# Altium schematic sheet GS_02_Pow.SchDoc: Title
size A3; Date: Date; CompanyName: Integrated Micro-Electronics Bulgaria; Organization: Design & Development Department; Address1: Drawing Type; Address2: Address 1; Address3: Address 2; Address4: Address 3; DocumentNumber: 730xxx; Revision: 01; SheetNumber: 1; SheetTotal: 1; PageSetup: Record=PageOptions|CenterHorizontal=True|CenterVertical=True|PrintScale=0.70|XCorrection=1.00|YCorrection=1.00|PrintKind=2|BorderSize=5000000|LeftOffset=0|BottomOffset=0|Orientation=2|PaperLength=1000|PaperWidth=1000|Scale=100|PaperSource=7|PrintQuality=-4|MediaType=1|DitherType=10|PaperKind=A4|PrintScaleMode=1; SheetSize: A3; Time: Time; ModifiedDate: Mod. Date
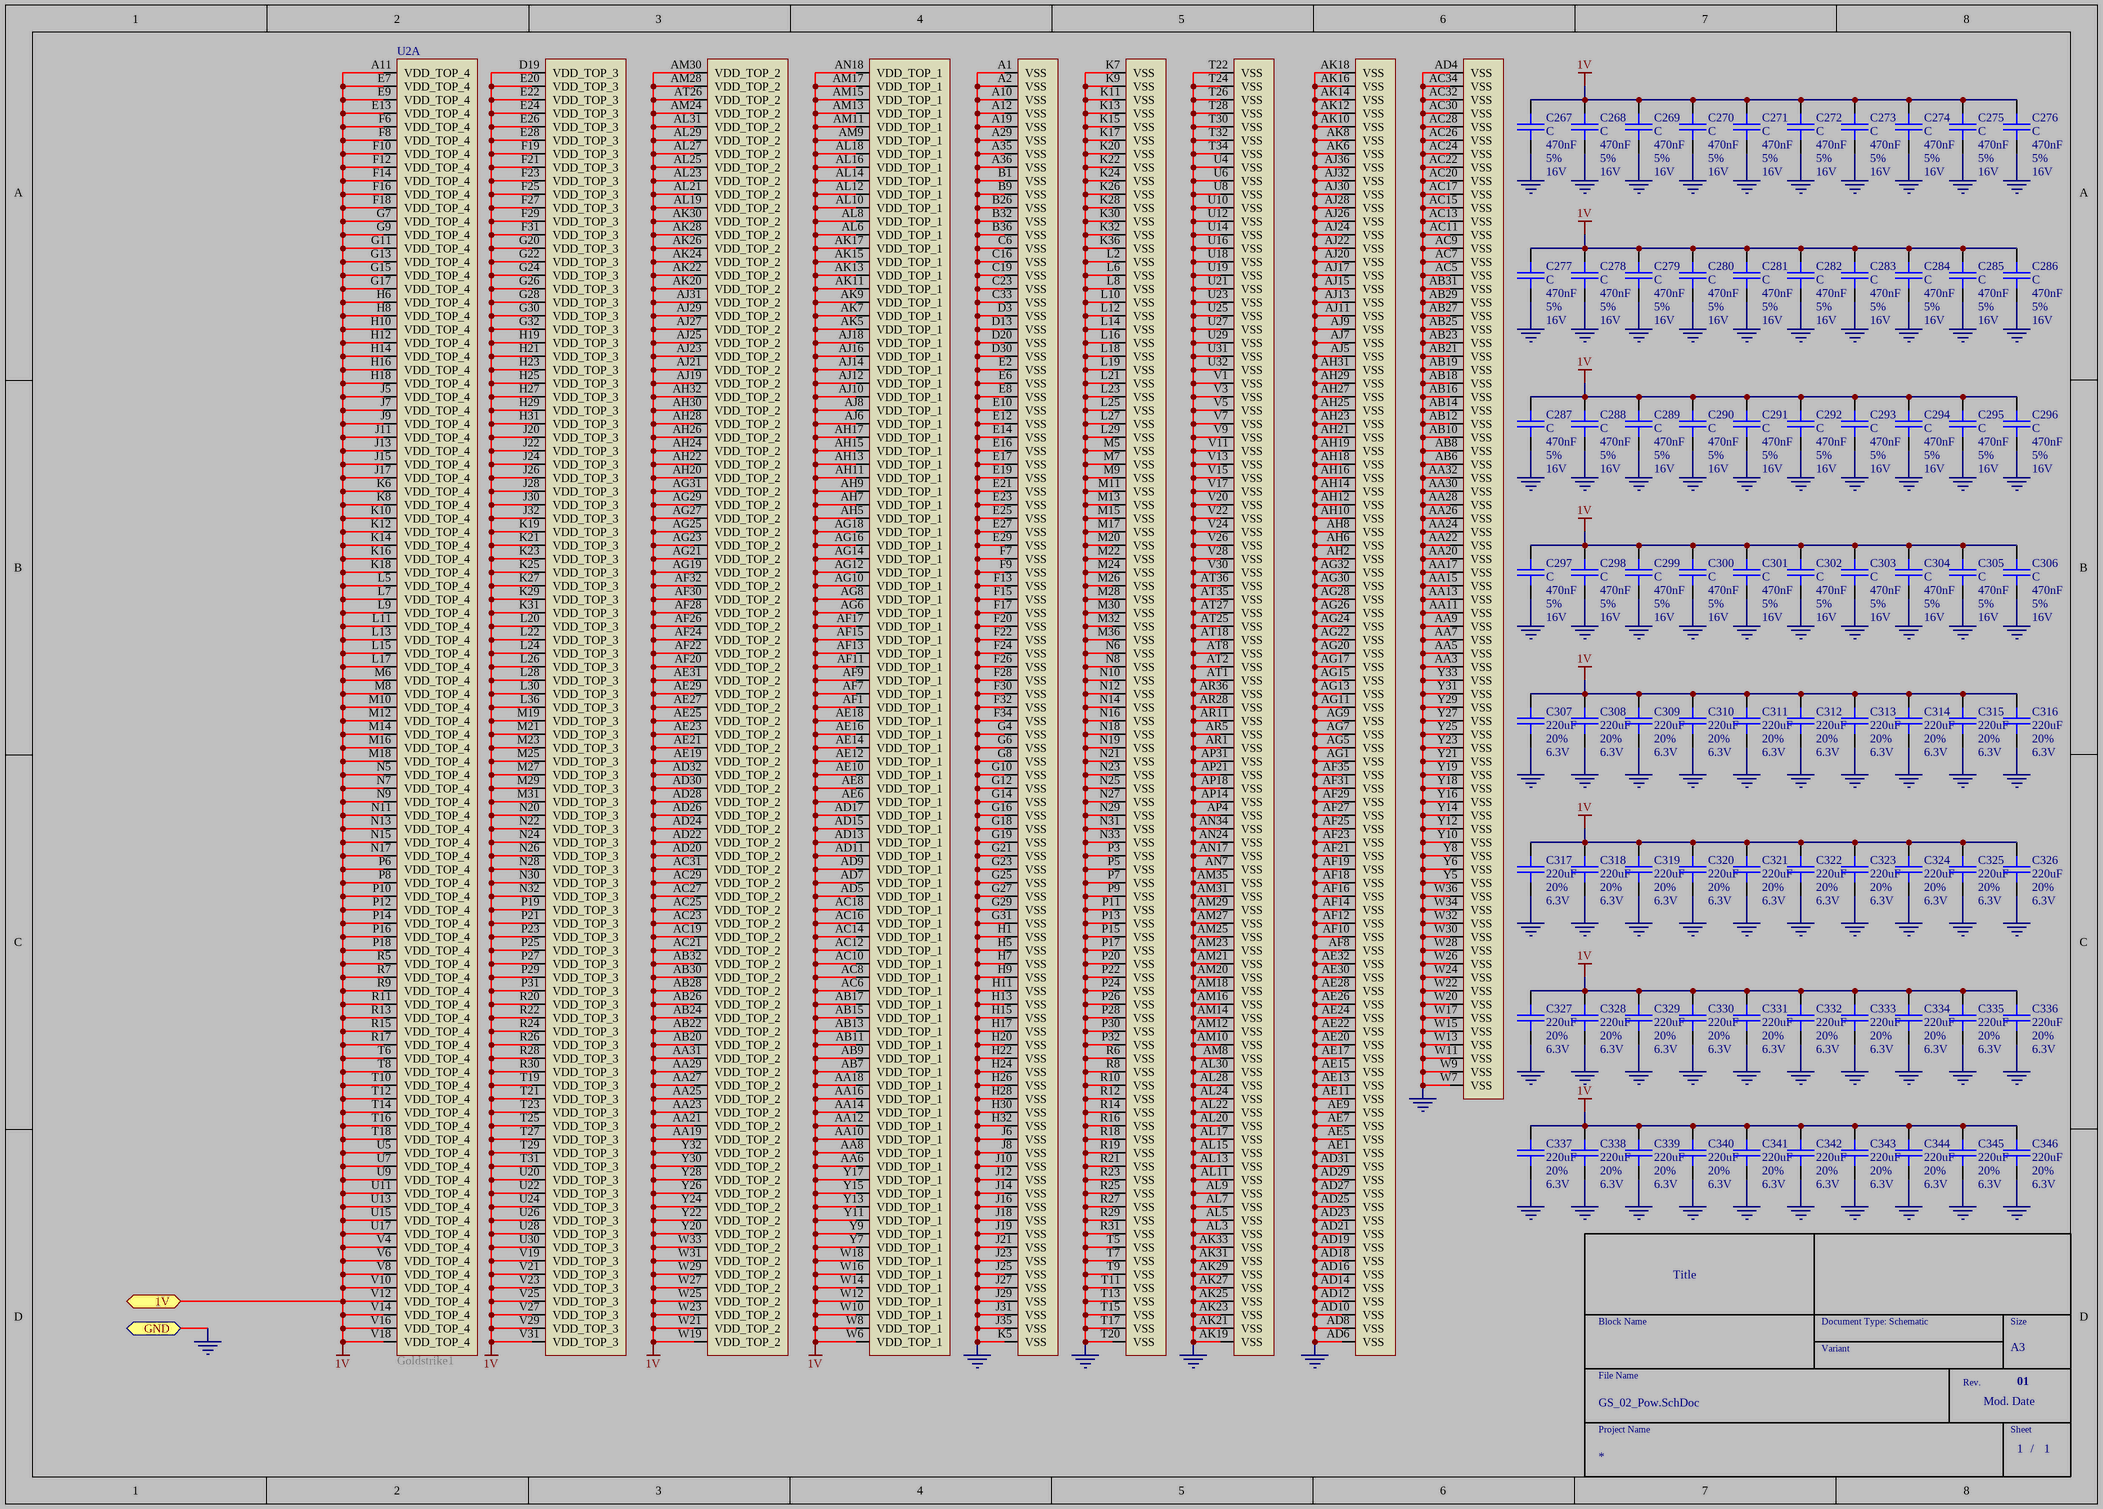
[diagram p0: GS_02_Pow.SchDoc]

## Parts
C267  C  DB_VALUE: 470nF  DB_TOLERANCE: 5%  DB_VOLTAGE: 16V  [SMD_0603_CAPC1608X95N]
C268  C  DB_VALUE: 470nF  DB_TOLERANCE: 5%  DB_VOLTAGE: 16V  [SMD_0603_CAPC1608X95N]
C269  C  DB_VALUE: 470nF  DB_TOLERANCE: 5%  DB_VOLTAGE: 16V  [SMD_0603_CAPC1608X95N]
C270  C  DB_VALUE: 470nF  DB_TOLERANCE: 5%  DB_VOLTAGE: 16V  [SMD_0603_CAPC1608X95N]
C271  C  DB_VALUE: 470nF  DB_TOLERANCE: 5%  DB_VOLTAGE: 16V  [SMD_0603_CAPC1608X95N]
C272  C  DB_VALUE: 470nF  DB_TOLERANCE: 5%  DB_VOLTAGE: 16V  [SMD_0603_CAPC1608X95N]
C273  C  DB_VALUE: 470nF  DB_TOLERANCE: 5%  DB_VOLTAGE: 16V  [SMD_0603_CAPC1608X95N]
C274  C  DB_VALUE: 470nF  DB_TOLERANCE: 5%  DB_VOLTAGE: 16V  [SMD_0603_CAPC1608X95N]
C275  C  DB_VALUE: 470nF  DB_TOLERANCE: 5%  DB_VOLTAGE: 16V  [SMD_0603_CAPC1608X95N]
C276  C  DB_VALUE: 470nF  DB_TOLERANCE: 5%  DB_VOLTAGE: 16V  [SMD_0603_CAPC1608X95N]
C277  C  DB_VALUE: 470nF  DB_TOLERANCE: 5%  DB_VOLTAGE: 16V  [SMD_0603_CAPC1608X95N]
C278  C  DB_VALUE: 470nF  DB_TOLERANCE: 5%  DB_VOLTAGE: 16V  [SMD_0603_CAPC1608X95N]
C279  C  DB_VALUE: 470nF  DB_TOLERANCE: 5%  DB_VOLTAGE: 16V  [SMD_0603_CAPC1608X95N]
C280  C  DB_VALUE: 470nF  DB_TOLERANCE: 5%  DB_VOLTAGE: 16V  [SMD_0603_CAPC1608X95N]
C281  C  DB_VALUE: 470nF  DB_TOLERANCE: 5%  DB_VOLTAGE: 16V  [SMD_0603_CAPC1608X95N]
C282  C  DB_VALUE: 470nF  DB_TOLERANCE: 5%  DB_VOLTAGE: 16V  [SMD_0603_CAPC1608X95N]
C283  C  DB_VALUE: 470nF  DB_TOLERANCE: 5%  DB_VOLTAGE: 16V  [SMD_0603_CAPC1608X95N]
C284  C  DB_VALUE: 470nF  DB_TOLERANCE: 5%  DB_VOLTAGE: 16V  [SMD_0603_CAPC1608X95N]
C285  C  DB_VALUE: 470nF  DB_TOLERANCE: 5%  DB_VOLTAGE: 16V  [SMD_0603_CAPC1608X95N]
C286  C  DB_VALUE: 470nF  DB_TOLERANCE: 5%  DB_VOLTAGE: 16V  [SMD_0603_CAPC1608X95N]
C287  C  DB_VALUE: 470nF  DB_TOLERANCE: 5%  DB_VOLTAGE: 16V  [SMD_0603_CAPC1608X95N]
C288  C  DB_VALUE: 470nF  DB_TOLERANCE: 5%  DB_VOLTAGE: 16V  [SMD_0603_CAPC1608X95N]
C289  C  DB_VALUE: 470nF  DB_TOLERANCE: 5%  DB_VOLTAGE: 16V  [SMD_0603_CAPC1608X95N]
C290  C  DB_VALUE: 470nF  DB_TOLERANCE: 5%  DB_VOLTAGE: 16V  [SMD_0603_CAPC1608X95N]
C291  C  DB_VALUE: 470nF  DB_TOLERANCE: 5%  DB_VOLTAGE: 16V  [SMD_0603_CAPC1608X95N]
C292  C  DB_VALUE: 470nF  DB_TOLERANCE: 5%  DB_VOLTAGE: 16V  [SMD_0603_CAPC1608X95N]
C293  C  DB_VALUE: 470nF  DB_TOLERANCE: 5%  DB_VOLTAGE: 16V  [SMD_0603_CAPC1608X95N]
C294  C  DB_VALUE: 470nF  DB_TOLERANCE: 5%  DB_VOLTAGE: 16V  [SMD_0603_CAPC1608X95N]
C295  C  DB_VALUE: 470nF  DB_TOLERANCE: 5%  DB_VOLTAGE: 16V  [SMD_0603_CAPC1608X95N]
C296  C  DB_VALUE: 470nF  DB_TOLERANCE: 5%  DB_VOLTAGE: 16V  [SMD_0603_CAPC1608X95N]
C297  C  DB_VALUE: 470nF  DB_TOLERANCE: 5%  DB_VOLTAGE: 16V  [SMD_0603_CAPC1608X95N]
C298  C  DB_VALUE: 470nF  DB_TOLERANCE: 5%  DB_VOLTAGE: 16V  [SMD_0603_CAPC1608X95N]
C299  C  DB_VALUE: 470nF  DB_TOLERANCE: 5%  DB_VOLTAGE: 16V  [SMD_0603_CAPC1608X95N]
C300  C  DB_VALUE: 470nF  DB_TOLERANCE: 5%  DB_VOLTAGE: 16V  [SMD_0603_CAPC1608X95N]
C301  C  DB_VALUE: 470nF  DB_TOLERANCE: 5%  DB_VOLTAGE: 16V  [SMD_0603_CAPC1608X95N]
C302  C  DB_VALUE: 470nF  DB_TOLERANCE: 5%  DB_VOLTAGE: 16V  [SMD_0603_CAPC1608X95N]
C303  C  DB_VALUE: 470nF  DB_TOLERANCE: 5%  DB_VOLTAGE: 16V  [SMD_0603_CAPC1608X95N]
C304  C  DB_VALUE: 470nF  DB_TOLERANCE: 5%  DB_VOLTAGE: 16V  [SMD_0603_CAPC1608X95N]
C305  C  DB_VALUE: 470nF  DB_TOLERANCE: 5%  DB_VOLTAGE: 16V  [SMD_0603_CAPC1608X95N]
C306  C  DB_VALUE: 470nF  DB_TOLERANCE: 5%  DB_VOLTAGE: 16V  [SMD_0603_CAPC1608X95N]
C307  DB_VALUE: 220uF  DB_TOLERANCE: 20%  DB_VOLTAGE: 6.3V  [SMD_1210_CAPC3225X279N]  (hidden comment: C)
C308  DB_VALUE: 220uF  DB_TOLERANCE: 20%  DB_VOLTAGE: 6.3V  [SMD_1210_CAPC3225X279N]  (hidden comment: C)
C309  DB_VALUE: 220uF  DB_TOLERANCE: 20%  DB_VOLTAGE: 6.3V  [SMD_1210_CAPC3225X279N]  (hidden comment: C)
C310  DB_VALUE: 220uF  DB_TOLERANCE: 20%  DB_VOLTAGE: 6.3V  [SMD_1210_CAPC3225X279N]  (hidden comment: C)
C311  DB_VALUE: 220uF  DB_TOLERANCE: 20%  DB_VOLTAGE: 6.3V  [SMD_1210_CAPC3225X279N]  (hidden comment: C)
C312  DB_VALUE: 220uF  DB_TOLERANCE: 20%  DB_VOLTAGE: 6.3V  [SMD_1210_CAPC3225X279N]  (hidden comment: C)
C313  DB_VALUE: 220uF  DB_TOLERANCE: 20%  DB_VOLTAGE: 6.3V  [SMD_1210_CAPC3225X279N]  (hidden comment: C)
C314  DB_VALUE: 220uF  DB_TOLERANCE: 20%  DB_VOLTAGE: 6.3V  [SMD_1210_CAPC3225X279N]  (hidden comment: C)
C315  DB_VALUE: 220uF  DB_TOLERANCE: 20%  DB_VOLTAGE: 6.3V  [SMD_1210_CAPC3225X279N]  (hidden comment: C)
C316  DB_VALUE: 220uF  DB_TOLERANCE: 20%  DB_VOLTAGE: 6.3V  [SMD_1210_CAPC3225X279N]  (hidden comment: C)
C317  DB_VALUE: 220uF  DB_TOLERANCE: 20%  DB_VOLTAGE: 6.3V  [SMD_1210_CAPC3225X279N]  (hidden comment: C)
C318  DB_VALUE: 220uF  DB_TOLERANCE: 20%  DB_VOLTAGE: 6.3V  [SMD_1210_CAPC3225X279N]  (hidden comment: C)
C319  DB_VALUE: 220uF  DB_TOLERANCE: 20%  DB_VOLTAGE: 6.3V  [SMD_1210_CAPC3225X279N]  (hidden comment: C)
C320  DB_VALUE: 220uF  DB_TOLERANCE: 20%  DB_VOLTAGE: 6.3V  [SMD_1210_CAPC3225X279N]  (hidden comment: C)
C321  DB_VALUE: 220uF  DB_TOLERANCE: 20%  DB_VOLTAGE: 6.3V  [SMD_1210_CAPC3225X279N]  (hidden comment: C)
C322  DB_VALUE: 220uF  DB_TOLERANCE: 20%  DB_VOLTAGE: 6.3V  [SMD_1210_CAPC3225X279N]  (hidden comment: C)
C323  DB_VALUE: 220uF  DB_TOLERANCE: 20%  DB_VOLTAGE: 6.3V  [SMD_1210_CAPC3225X279N]  (hidden comment: C)
C324  DB_VALUE: 220uF  DB_TOLERANCE: 20%  DB_VOLTAGE: 6.3V  [SMD_1210_CAPC3225X279N]  (hidden comment: C)
C325  DB_VALUE: 220uF  DB_TOLERANCE: 20%  DB_VOLTAGE: 6.3V  [SMD_1210_CAPC3225X279N]  (hidden comment: C)
C326  DB_VALUE: 220uF  DB_TOLERANCE: 20%  DB_VOLTAGE: 6.3V  [SMD_1210_CAPC3225X279N]  (hidden comment: C)
C327  DB_VALUE: 220uF  DB_TOLERANCE: 20%  DB_VOLTAGE: 6.3V  [SMD_1210_CAPC3225X279N]  (hidden comment: C)
C328  DB_VALUE: 220uF  DB_TOLERANCE: 20%  DB_VOLTAGE: 6.3V  [SMD_1210_CAPC3225X279N]  (hidden comment: C)
C329  DB_VALUE: 220uF  DB_TOLERANCE: 20%  DB_VOLTAGE: 6.3V  [SMD_1210_CAPC3225X279N]  (hidden comment: C)
C330  DB_VALUE: 220uF  DB_TOLERANCE: 20%  DB_VOLTAGE: 6.3V  [SMD_1210_CAPC3225X279N]  (hidden comment: C)
C331  DB_VALUE: 220uF  DB_TOLERANCE: 20%  DB_VOLTAGE: 6.3V  [SMD_1210_CAPC3225X279N]  (hidden comment: C)
C332  DB_VALUE: 220uF  DB_TOLERANCE: 20%  DB_VOLTAGE: 6.3V  [SMD_1210_CAPC3225X279N]  (hidden comment: C)
C333  DB_VALUE: 220uF  DB_TOLERANCE: 20%  DB_VOLTAGE: 6.3V  [SMD_1210_CAPC3225X279N]  (hidden comment: C)
C334  DB_VALUE: 220uF  DB_TOLERANCE: 20%  DB_VOLTAGE: 6.3V  [SMD_1210_CAPC3225X279N]  (hidden comment: C)
C335  DB_VALUE: 220uF  DB_TOLERANCE: 20%  DB_VOLTAGE: 6.3V  [SMD_1210_CAPC3225X279N]  (hidden comment: C)
C336  DB_VALUE: 220uF  DB_TOLERANCE: 20%  DB_VOLTAGE: 6.3V  [SMD_1210_CAPC3225X279N]  (hidden comment: C)
C337  DB_VALUE: 220uF  DB_TOLERANCE: 20%  DB_VOLTAGE: 6.3V  [SMD_1210_CAPC3225X279N]  (hidden comment: C)
C338  DB_VALUE: 220uF  DB_TOLERANCE: 20%  DB_VOLTAGE: 6.3V  [SMD_1210_CAPC3225X279N]  (hidden comment: C)
C339  DB_VALUE: 220uF  DB_TOLERANCE: 20%  DB_VOLTAGE: 6.3V  [SMD_1210_CAPC3225X279N]  (hidden comment: C)
C340  DB_VALUE: 220uF  DB_TOLERANCE: 20%  DB_VOLTAGE: 6.3V  [SMD_1210_CAPC3225X279N]  (hidden comment: C)
C341  DB_VALUE: 220uF  DB_TOLERANCE: 20%  DB_VOLTAGE: 6.3V  [SMD_1210_CAPC3225X279N]  (hidden comment: C)
C342  DB_VALUE: 220uF  DB_TOLERANCE: 20%  DB_VOLTAGE: 6.3V  [SMD_1210_CAPC3225X279N]  (hidden comment: C)
C343  DB_VALUE: 220uF  DB_TOLERANCE: 20%  DB_VOLTAGE: 6.3V  [SMD_1210_CAPC3225X279N]  (hidden comment: C)
C344  DB_VALUE: 220uF  DB_TOLERANCE: 20%  DB_VOLTAGE: 6.3V  [SMD_1210_CAPC3225X279N]  (hidden comment: C)
C345  DB_VALUE: 220uF  DB_TOLERANCE: 20%  DB_VOLTAGE: 6.3V  [SMD_1210_CAPC3225X279N]  (hidden comment: C)
C346  DB_VALUE: 220uF  DB_TOLERANCE: 20%  DB_VOLTAGE: 6.3V  [SMD_1210_CAPC3225X279N]  (hidden comment: C)
U2  Goldstrike1  [SMD_BGA1296C100P36X36]  (part A of 5)

## Ports
1V, GND

## Nets
1V: C267.2 C268.2 C269.2 C270.2 C271.2 C272.2 C273.2 C274.2 C275.2 C276.2 C277.2 C278.2 C279.2 C280.2 C281.2 C282.2 C283.2 C284.2 C285.2 C286.2 C287.2 C288.2 C289.2 C290.2 C291.2 C292.2 C293.2 C294.2 C295.2 C296.2 C297.2 C298.2 C299.2 C300.2 C301.2 C302.2 C303.2 C304.2 C305.2 C306.2 C307.2 C308.2 C309.2 C310.2 C311.2 C312.2 C313.2 C314.2 C315.2 C316.2 C317.2 C318.2 C319.2 C320.2 C321.2 C322.2 C323.2 C324.2 C325.2 C326.2 C327.2 C328.2 C329.2 C330.2 C331.2 C332.2 C333.2 C334.2 C335.2 C336.2 C337.2 C338.2 C339.2 C340.2 C341.2 C342.2 C343.2 C344.2 C345.2 C346.2 U2.A11(VDD_TOP_4) U2.AA6(VDD_TOP_1) U2.AA8(VDD_TOP_1) U2.AA10(VDD_TOP_1) U2.AA12(VDD_TOP_1) U2.AA14(VDD_TOP_1) U2.AA16(VDD_TOP_1) U2.AA18(VDD_TOP_1) U2.AA19(VDD_TOP_2) U2.AA21(VDD_TOP_2) U2.AA23(VDD_TOP_2) U2.AA25(VDD_TOP_2) U2.AA27(VDD_TOP_2) U2.AA29(VDD_TOP_2) U2.AA31(VDD_TOP_2) U2.AB7(VDD_TOP_1) U2.AB9(VDD_TOP_1) U2.AB11(VDD_TOP_1) U2.AB13(VDD_TOP_1) U2.AB15(VDD_TOP_1) U2.AB17(VDD_TOP_1) U2.AB20(VDD_TOP_2) U2.AB22(VDD_TOP_2) U2.AB24(VDD_TOP_2) U2.AB26(VDD_TOP_2) U2.AB28(VDD_TOP_2) U2.AB30(VDD_TOP_2) U2.AB32(VDD_TOP_2) U2.AC6(VDD_TOP_1) U2.AC8(VDD_TOP_1) U2.AC10(VDD_TOP_1) U2.AC12(VDD_TOP_1) U2.AC14(VDD_TOP_1) U2.AC16(VDD_TOP_1) U2.AC18(VDD_TOP_1) U2.AC19(VDD_TOP_2) U2.AC21(VDD_TOP_2) U2.AC23(VDD_TOP_2) U2.AC25(VDD_TOP_2) U2.AC27(VDD_TOP_2) U2.AC29(VDD_TOP_2) U2.AC31(VDD_TOP_2) U2.AD5(VDD_TOP_1) U2.AD7(VDD_TOP_1) U2.AD9(VDD_TOP_1) U2.AD11(VDD_TOP_1) U2.AD13(VDD_TOP_1) U2.AD15(VDD_TOP_1) U2.AD17(VDD_TOP_1) U2.AD20(VDD_TOP_2) U2.AD22(VDD_TOP_2) U2.AD24(VDD_TOP_2) U2.AD26(VDD_TOP_2) U2.AD28(VDD_TOP_2) U2.AD30(VDD_TOP_2) U2.AD32(VDD_TOP_2) U2.AE6(VDD_TOP_1) U2.AE8(VDD_TOP_1) U2.AE10(VDD_TOP_1) U2.AE12(VDD_TOP_1) U2.AE14(VDD_TOP_1) U2.AE16(VDD_TOP_1) U2.AE18(VDD_TOP_1) U2.AE19(VDD_TOP_2) U2.AE21(VDD_TOP_2) U2.AE23(VDD_TOP_2) U2.AE25(VDD_TOP_2) U2.AE27(VDD_TOP_2) U2.AE29(VDD_TOP_2) U2.AE31(VDD_TOP_2) U2.AF1(VDD_TOP_1) U2.AF7(VDD_TOP_1) U2.AF9(VDD_TOP_1) U2.AF11(VDD_TOP_1) U2.AF13(VDD_TOP_1) U2.AF15(VDD_TOP_1) U2.AF17(VDD_TOP_1) U2.AF20(VDD_TOP_2) U2.AF22(VDD_TOP_2) U2.AF24(VDD_TOP_2) U2.AF26(VDD_TOP_2) U2.AF28(VDD_TOP_2) U2.AF30(VDD_TOP_2) U2.AF32(VDD_TOP_2) U2.AG6(VDD_TOP_1) U2.AG8(VDD_TOP_1) U2.AG10(VDD_TOP_1) U2.AG12(VDD_TOP_1) U2.AG14(VDD_TOP_1) U2.AG16(VDD_TOP_1) U2.AG18(VDD_TOP_1) U2.AG19(VDD_TOP_2) U2.AG21(VDD_TOP_2) U2.AG23(VDD_TOP_2) U2.AG25(VDD_TOP_2) U2.AG27(VDD_TOP_2) U2.AG29(VDD_TOP_2) U2.AG31(VDD_TOP_2) U2.AH5(VDD_TOP_1) U2.AH7(VDD_TOP_1) U2.AH9(VDD_TOP_1) U2.AH11(VDD_TOP_1) U2.AH13(VDD_TOP_1) U2.AH15(VDD_TOP_1) U2.AH17(VDD_TOP_1) U2.AH20(VDD_TOP_2) U2.AH22(VDD_TOP_2) U2.AH24(VDD_TOP_2) U2.AH26(VDD_TOP_2) U2.AH28(VDD_TOP_2) U2.AH30(VDD_TOP_2) U2.AH32(VDD_TOP_2) U2.AJ6(VDD_TOP_1) U2.AJ8(VDD_TOP_1) U2.AJ10(VDD_TOP_1) U2.AJ12(VDD_TOP_1) U2.AJ14(VDD_TOP_1) U2.AJ16(VDD_TOP_1) U2.AJ18(VDD_TOP_1) U2.AJ19(VDD_TOP_2) U2.AJ21(VDD_TOP_2) U2.AJ23(VDD_TOP_2) U2.AJ25(VDD_TOP_2) U2.AJ27(VDD_TOP_2) U2.AJ29(VDD_TOP_2) U2.AJ31(VDD_TOP_2) U2.AK5(VDD_TOP_1) U2.AK7(VDD_TOP_1) U2.AK9(VDD_TOP_1) U2.AK11(VDD_TOP_1) U2.AK13(VDD_TOP_1) U2.AK15(VDD_TOP_1) U2.AK17(VDD_TOP_1) U2.AK20(VDD_TOP_2) U2.AK22(VDD_TOP_2) U2.AK24(VDD_TOP_2) U2.AK26(VDD_TOP_2) U2.AK28(VDD_TOP_2) U2.AK30(VDD_TOP_2) U2.AL6(VDD_TOP_1) U2.AL8(VDD_TOP_1) U2.AL10(VDD_TOP_1) U2.AL12(VDD_TOP_1) U2.AL14(VDD_TOP_1) U2.AL16(VDD_TOP_1) U2.AL18(VDD_TOP_1) U2.AL19(VDD_TOP_2) U2.AL21(VDD_TOP_2) U2.AL23(VDD_TOP_2) U2.AL25(VDD_TOP_2) U2.AL27(VDD_TOP_2) U2.AL29(VDD_TOP_2) U2.AL31(VDD_TOP_2) U2.AM9(VDD_TOP_1) U2.AM11(VDD_TOP_1) U2.AM13(VDD_TOP_1) U2.AM15(VDD_TOP_1) U2.AM17(VDD_TOP_1) U2.AM24(VDD_TOP_2) U2.AM28(VDD_TOP_2) U2.AM30(VDD_TOP_2) U2.AN18(VDD_TOP_1) U2.AT26(VDD_TOP_2) U2.D19(VDD_TOP_3) U2.E7(VDD_TOP_4) U2.E9(VDD_TOP_4) U2.E13(VDD_TOP_4) U2.E20(VDD_TOP_3) U2.E22(VDD_TOP_3) U2.E24(VDD_TOP_3) U2.E26(VDD_TOP_3) U2.E28(VDD_TOP_3) U2.F6(VDD_TOP_4) U2.F8(VDD_TOP_4) U2.F10(VDD_TOP_4) U2.F12(VDD_TOP_4) U2.F14(VDD_TOP_4) U2.F16(VDD_TOP_4) U2.F18(VDD_TOP_4) U2.F19(VDD_TOP_3) U2.F21(VDD_TOP_3) U2.F23(VDD_TOP_3) U2.F25(VDD_TOP_3) U2.F27(VDD_TOP_3) U2.F29(VDD_TOP_3) U2.F31(VDD_TOP_3) U2.G7(VDD_TOP_4) U2.G9(VDD_TOP_4) U2.G11(VDD_TOP_4) U2.G13(VDD_TOP_4) U2.G15(VDD_TOP_4) U2.G17(VDD_TOP_4) U2.G20(VDD_TOP_3) U2.G22(VDD_TOP_3) U2.G24(VDD_TOP_3) U2.G26(VDD_TOP_3) U2.G28(VDD_TOP_3) U2.G30(VDD_TOP_3) U2.G32(VDD_TOP_3) U2.H6(VDD_TOP_4) U2.H8(VDD_TOP_4) U2.H10(VDD_TOP_4) U2.H12(VDD_TOP_4) U2.H14(VDD_TOP_4) U2.H16(VDD_TOP_4) U2.H18(VDD_TOP_4) U2.H19(VDD_TOP_3) U2.H21(VDD_TOP_3) U2.H23(VDD_TOP_3) U2.H25(VDD_TOP_3) U2.H27(VDD_TOP_3) U2.H29(VDD_TOP_3) U2.H31(VDD_TOP_3) U2.J5(VDD_TOP_4) U2.J7(VDD_TOP_4) U2.J9(VDD_TOP_4) U2.J11(VDD_TOP_4) U2.J13(VDD_TOP_4) U2.J15(VDD_TOP_4) U2.J17(VDD_TOP_4) U2.J20(VDD_TOP_3) U2.J22(VDD_TOP_3) U2.J24(VDD_TOP_3) U2.J26(VDD_TOP_3) U2.J28(VDD_TOP_3) U2.J30(VDD_TOP_3) U2.J32(VDD_TOP_3) U2.K6(VDD_TOP_4) U2.K8(VDD_TOP_4) U2.K10(VDD_TOP_4) U2.K12(VDD_TOP_4) U2.K14(VDD_TOP_4) U2.K16(VDD_TOP_4) U2.K18(VDD_TOP_4) U2.K19(VDD_TOP_3) U2.K21(VDD_TOP_3) U2.K23(VDD_TOP_3) U2.K25(VDD_TOP_3) U2.K27(VDD_TOP_3) U2.K29(VDD_TOP_3) U2.K31(VDD_TOP_3) U2.L5(VDD_TOP_4) U2.L7(VDD_TOP_4) U2.L9(VDD_TOP_4) U2.L11(VDD_TOP_4) U2.L13(VDD_TOP_4) U2.L15(VDD_TOP_4) U2.L17(VDD_TOP_4) U2.L20(VDD_TOP_3) U2.L22(VDD_TOP_3) U2.L24(VDD_TOP_3) U2.L26(VDD_TOP_3) U2.L28(VDD_TOP_3) U2.L30(VDD_TOP_3) U2.L36(VDD_TOP_3) U2.M6(VDD_TOP_4) U2.M8(VDD_TOP_4) U2.M10(VDD_TOP_4) U2.M12(VDD_TOP_4) U2.M14(VDD_TOP_4) U2.M16(VDD_TOP_4) U2.M18(VDD_TOP_4) U2.M19(VDD_TOP_3) U2.M21(VDD_TOP_3) U2.M23(VDD_TOP_3) U2.M25(VDD_TOP_3) U2.M27(VDD_TOP_3) U2.M29(VDD_TOP_3) U2.M31(VDD_TOP_3) U2.N5(VDD_TOP_4) U2.N7(VDD_TOP_4) U2.N9(VDD_TOP_4) U2.N11(VDD_TOP_4) U2.N13(VDD_TOP_4) U2.N15(VDD_TOP_4) U2.N17(VDD_TOP_4) U2.N20(VDD_TOP_3) U2.N22(VDD_TOP_3) U2.N24(VDD_TOP_3) U2.N26(VDD_TOP_3) U2.N28(VDD_TOP_3) U2.N30(VDD_TOP_3) U2.N32(VDD_TOP_3) U2.P6(VDD_TOP_4) U2.P8(VDD_TOP_4) U2.P10(VDD_TOP_4) U2.P12(VDD_TOP_4) U2.P14(VDD_TOP_4) U2.P16(VDD_TOP_4) U2.P18(VDD_TOP_4) U2.P19(VDD_TOP_3) U2.P21(VDD_TOP_3) U2.P23(VDD_TOP_3) U2.P25(VDD_TOP_3) U2.P27(VDD_TOP_3) U2.P29(VDD_TOP_3) U2.P31(VDD_TOP_3) U2.R5(VDD_TOP_4) U2.R7(VDD_TOP_4) U2.R9(VDD_TOP_4) U2.R11(VDD_TOP_4) U2.R13(VDD_TOP_4) U2.R15(VDD_TOP_4) U2.R17(VDD_TOP_4) U2.R20(VDD_TOP_3) U2.R22(VDD_TOP_3) U2.R24(VDD_TOP_3) U2.R26(VDD_TOP_3) U2.R28(VDD_TOP_3) U2.R30(VDD_TOP_3) U2.T6(VDD_TOP_4) U2.T8(VDD_TOP_4) U2.T10(VDD_TOP_4) U2.T12(VDD_TOP_4) U2.T14(VDD_TOP_4) U2.T16(VDD_TOP_4) U2.T18(VDD_TOP_4) U2.T19(VDD_TOP_3) U2.T21(VDD_TOP_3) U2.T23(VDD_TOP_3) U2.T25(VDD_TOP_3) U2.T27(VDD_TOP_3) U2.T29(VDD_TOP_3) U2.T31(VDD_TOP_3) U2.U5(VDD_TOP_4) U2.U7(VDD_TOP_4) U2.U9(VDD_TOP_4) U2.U11(VDD_TOP_4) U2.U13(VDD_TOP_4) U2.U15(VDD_TOP_4) U2.U17(VDD_TOP_4) U2.U20(VDD_TOP_3) U2.U22(VDD_TOP_3) U2.U24(VDD_TOP_3) U2.U26(VDD_TOP_3) U2.U28(VDD_TOP_3) U2.U30(VDD_TOP_3) U2.V4(VDD_TOP_4) U2.V6(VDD_TOP_4) U2.V8(VDD_TOP_4) U2.V10(VDD_TOP_4) U2.V12(VDD_TOP_4) U2.V14(VDD_TOP_4) U2.V16(VDD_TOP_4) U2.V18(VDD_TOP_4) U2.V19(VDD_TOP_3) U2.V21(VDD_TOP_3) U2.V23(VDD_TOP_3) U2.V25(VDD_TOP_3) U2.V27(VDD_TOP_3) U2.V29(VDD_TOP_3) U2.V31(VDD_TOP_3) U2.W6(VDD_TOP_1) U2.W8(VDD_TOP_1) U2.W10(VDD_TOP_1) U2.W12(VDD_TOP_1) U2.W14(VDD_TOP_1) U2.W16(VDD_TOP_1) U2.W18(VDD_TOP_1) U2.W19(VDD_TOP_2) U2.W21(VDD_TOP_2) U2.W23(VDD_TOP_2) U2.W25(VDD_TOP_2) U2.W27(VDD_TOP_2) U2.W29(VDD_TOP_2) U2.W31(VDD_TOP_2) U2.W33(VDD_TOP_2) U2.Y7(VDD_TOP_1) U2.Y9(VDD_TOP_1) U2.Y11(VDD_TOP_1) U2.Y13(VDD_TOP_1) U2.Y15(VDD_TOP_1) U2.Y17(VDD_TOP_1) U2.Y20(VDD_TOP_2) U2.Y22(VDD_TOP_2) U2.Y24(VDD_TOP_2) U2.Y26(VDD_TOP_2) U2.Y28(VDD_TOP_2) U2.Y30(VDD_TOP_2) U2.Y32(VDD_TOP_2) ; port 1V
GND: C267.1 C268.1 C269.1 C270.1 C271.1 C272.1 C273.1 C274.1 C275.1 C276.1 C277.1 C278.1 C279.1 C280.1 C281.1 C282.1 C283.1 C284.1 C285.1 C286.1 C287.1 C288.1 C289.1 C290.1 C291.1 C292.1 C293.1 C294.1 C295.1 C296.1 C297.1 C298.1 C299.1 C300.1 C301.1 C302.1 C303.1 C304.1 C305.1 C306.1 C307.1 C308.1 C309.1 C310.1 C311.1 C312.1 C313.1 C314.1 C315.1 C316.1 C317.1 C318.1 C319.1 C320.1 C321.1 C322.1 C323.1 C324.1 C325.1 C326.1 C327.1 C328.1 C329.1 C330.1 C331.1 C332.1 C333.1 C334.1 C335.1 C336.1 C337.1 C338.1 C339.1 C340.1 C341.1 C342.1 C343.1 C344.1 C345.1 C346.1 U2.A1(VSS) U2.A2(VSS) U2.A10(VSS) U2.A12(VSS) U2.A19(VSS) U2.A29(VSS) U2.A35(VSS) U2.A36(VSS) U2.AA3(VSS) U2.AA5(VSS) U2.AA7(VSS) U2.AA9(VSS) U2.AA11(VSS) U2.AA13(VSS) U2.AA15(VSS) U2.AA17(VSS) U2.AA20(VSS) U2.AA22(VSS) U2.AA24(VSS) U2.AA26(VSS) U2.AA28(VSS) U2.AA30(VSS) U2.AA32(VSS) U2.AB6(VSS) U2.AB8(VSS) U2.AB10(VSS) U2.AB12(VSS) U2.AB14(VSS) U2.AB16(VSS) U2.AB18(VSS) U2.AB19(VSS) U2.AB21(VSS) U2.AB23(VSS) U2.AB25(VSS) U2.AB27(VSS) U2.AB29(VSS) U2.AB31(VSS) U2.AC5(VSS) U2.AC7(VSS) U2.AC9(VSS) U2.AC11(VSS) U2.AC13(VSS) U2.AC15(VSS) U2.AC17(VSS) U2.AC20(VSS) U2.AC22(VSS) U2.AC24(VSS) U2.AC26(VSS) U2.AC28(VSS) U2.AC30(VSS) U2.AC32(VSS) U2.AC34(VSS) U2.AD4(VSS) U2.AD6(VSS) U2.AD8(VSS) U2.AD10(VSS) U2.AD12(VSS) U2.AD14(VSS) U2.AD16(VSS) U2.AD18(VSS) U2.AD19(VSS) U2.AD21(VSS) U2.AD23(VSS) U2.AD25(VSS) U2.AD27(VSS) U2.AD29(VSS) U2.AD31(VSS) U2.AE1(VSS) U2.AE5(VSS) U2.AE7(VSS) U2.AE9(VSS) U2.AE11(VSS) U2.AE13(VSS) U2.AE15(VSS) U2.AE17(VSS) U2.AE20(VSS) U2.AE22(VSS) U2.AE24(VSS) U2.AE26(VSS) U2.AE28(VSS) U2.AE30(VSS) U2.AE32(VSS) U2.AF8(VSS) U2.AF10(VSS) U2.AF12(VSS) U2.AF14(VSS) U2.AF16(VSS) U2.AF18(VSS) U2.AF19(VSS) U2.AF21(VSS) U2.AF23(VSS) U2.AF25(VSS) U2.AF27(VSS) U2.AF29(VSS) U2.AF31(VSS) U2.AF35(VSS) U2.AG1(VSS) U2.AG5(VSS) U2.AG7(VSS) U2.AG9(VSS) U2.AG11(VSS) U2.AG13(VSS) U2.AG15(VSS) U2.AG17(VSS) U2.AG20(VSS) U2.AG22(VSS) U2.AG24(VSS) U2.AG26(VSS) U2.AG28(VSS) U2.AG30(VSS) U2.AG32(VSS) U2.AH2(VSS) U2.AH6(VSS) U2.AH8(VSS) U2.AH10(VSS) U2.AH12(VSS) U2.AH14(VSS) U2.AH16(VSS) U2.AH18(VSS) U2.AH19(VSS) U2.AH21(VSS) U2.AH23(VSS) U2.AH25(VSS) U2.AH27(VSS) U2.AH29(VSS) U2.AH31(VSS) U2.AJ5(VSS) U2.AJ7(VSS) U2.AJ9(VSS) U2.AJ11(VSS) U2.AJ13(VSS) U2.AJ15(VSS) U2.AJ17(VSS) U2.AJ20(VSS) U2.AJ22(VSS) U2.AJ24(VSS) U2.AJ26(VSS) U2.AJ28(VSS) U2.AJ30(VSS) U2.AJ32(VSS) U2.AJ36(VSS) U2.AK6(VSS) U2.AK8(VSS) U2.AK10(VSS) U2.AK12(VSS) U2.AK14(VSS) U2.AK16(VSS) U2.AK18(VSS) U2.AK19(VSS) U2.AK21(VSS) U2.AK23(VSS) U2.AK25(VSS) U2.AK27(VSS) U2.AK29(VSS) U2.AK31(VSS) U2.AK33(VSS) U2.AL3(VSS) U2.AL5(VSS) U2.AL7(VSS) U2.AL9(VSS) U2.AL11(VSS) U2.AL13(VSS) U2.AL15(VSS) U2.AL17(VSS) U2.AL20(VSS) U2.AL22(VSS) U2.AL24(VSS) U2.AL28(VSS) U2.AL30(VSS) U2.AM8(VSS) U2.AM10(VSS) U2.AM12(VSS) U2.AM14(VSS) U2.AM16(VSS) U2.AM18(VSS) U2.AM20(VSS) U2.AM21(VSS) U2.AM23(VSS) U2.AM25(VSS) U2.AM27(VSS) U2.AM29(VSS) U2.AM31(VSS) U2.AM35(VSS) U2.AN7(VSS) U2.AN17(VSS) U2.AN24(VSS) U2.AN34(VSS) U2.AP4(VSS) U2.AP14(VSS) U2.AP18(VSS) U2.AP21(VSS) U2.AP31(VSS) U2.AR1(VSS) U2.AR5(VSS) U2.AR11(VSS) U2.AR28(VSS) U2.AR36(VSS) U2.AT1(VSS) U2.AT2(VSS) U2.AT8(VSS) U2.AT18(VSS) U2.AT25(VSS) U2.AT27(VSS) U2.AT35(VSS) U2.AT36(VSS) U2.B1(VSS) U2.B9(VSS) U2.B26(VSS) U2.B32(VSS) U2.B36(VSS) U2.C6(VSS) U2.C16(VSS) U2.C19(VSS) U2.C23(VSS) U2.C33(VSS) U2.D3(VSS) U2.D13(VSS) U2.D20(VSS) U2.D30(VSS) U2.E2(VSS) U2.E6(VSS) U2.E8(VSS) U2.E10(VSS) U2.E12(VSS) U2.E14(VSS) U2.E16(VSS) U2.E17(VSS) U2.E19(VSS) U2.E21(VSS) U2.E23(VSS) U2.E25(VSS) U2.E27(VSS) U2.E29(VSS) U2.F7(VSS) U2.F9(VSS) U2.F13(VSS) U2.F15(VSS) U2.F17(VSS) U2.F20(VSS) U2.F22(VSS) U2.F24(VSS) U2.F26(VSS) U2.F28(VSS) U2.F30(VSS) U2.F32(VSS) U2.F34(VSS) U2.G4(VSS) U2.G6(VSS) U2.G8(VSS) U2.G10(VSS) U2.G12(VSS) U2.G14(VSS) U2.G16(VSS) U2.G18(VSS) U2.G19(VSS) U2.G21(VSS) U2.G23(VSS) U2.G25(VSS) U2.G27(VSS) U2.G29(VSS) U2.G31(VSS) U2.H1(VSS) U2.H5(VSS) U2.H7(VSS) U2.H9(VSS) U2.H11(VSS) U2.H13(VSS) U2.H15(VSS) U2.H17(VSS) U2.H20(VSS) U2.H22(VSS) U2.H24(VSS) U2.H26(VSS) U2.H28(VSS) U2.H30(VSS) U2.H32(VSS) U2.J6(VSS) U2.J8(VSS) U2.J10(VSS) U2.J12(VSS) U2.J14(VSS) U2.J16(VSS) U2.J18(VSS) U2.J19(VSS) U2.J21(VSS) U2.J23(VSS) U2.J25(VSS) U2.J27(VSS) U2.J29(VSS) U2.J31(VSS) U2.J35(VSS) U2.K5(VSS) U2.K7(VSS) U2.K9(VSS) U2.K11(VSS) U2.K13(VSS) U2.K15(VSS) U2.K17(VSS) U2.K20(VSS) U2.K22(VSS) U2.K24(VSS) U2.K26(VSS) U2.K28(VSS) U2.K30(VSS) U2.K32(VSS) U2.K36(VSS) U2.L2(VSS) U2.L6(VSS) U2.L8(VSS) U2.L10(VSS) U2.L12(VSS) U2.L14(VSS) U2.L16(VSS) U2.L18(VSS) U2.L19(VSS) U2.L21(VSS) U2.L23(VSS) U2.L25(VSS) U2.L27(VSS) U2.L29(VSS) U2.M5(VSS) U2.M7(VSS) U2.M9(VSS) U2.M11(VSS) U2.M13(VSS) U2.M15(VSS) U2.M17(VSS) U2.M20(VSS) U2.M22(VSS) U2.M24(VSS) U2.M26(VSS) U2.M28(VSS) U2.M30(VSS) U2.M32(VSS) U2.M36(VSS) U2.N6(VSS) U2.N8(VSS) U2.N10(VSS) U2.N12(VSS) U2.N14(VSS) U2.N16(VSS) U2.N18(VSS) U2.N19(VSS) U2.N21(VSS) U2.N23(VSS) U2.N25(VSS) U2.N27(VSS) U2.N29(VSS) U2.N31(VSS) U2.N33(VSS) U2.P3(VSS) U2.P5(VSS) U2.P7(VSS) U2.P9(VSS) U2.P11(VSS) U2.P13(VSS) U2.P15(VSS) U2.P17(VSS) U2.P20(VSS) U2.P22(VSS) U2.P24(VSS) U2.P26(VSS) U2.P28(VSS) U2.P30(VSS) U2.P32(VSS) U2.R6(VSS) U2.R8(VSS) U2.R10(VSS) U2.R12(VSS) U2.R14(VSS) U2.R16(VSS) U2.R18(VSS) U2.R19(VSS) U2.R21(VSS) U2.R23(VSS) U2.R25(VSS) U2.R27(VSS) U2.R29(VSS) U2.R31(VSS) U2.T5(VSS) U2.T7(VSS) U2.T9(VSS) U2.T11(VSS) U2.T13(VSS) U2.T15(VSS) U2.T17(VSS) U2.T20(VSS) U2.T22(VSS) U2.T24(VSS) U2.T26(VSS) U2.T28(VSS) U2.T30(VSS) U2.T32(VSS) U2.T34(VSS) U2.U4(VSS) U2.U6(VSS) U2.U8(VSS) U2.U10(VSS) U2.U12(VSS) U2.U14(VSS) U2.U16(VSS) U2.U18(VSS) U2.U19(VSS) U2.U21(VSS) U2.U23(VSS) U2.U25(VSS) U2.U27(VSS) U2.U29(VSS) U2.U31(VSS) U2.U32(VSS) U2.V1(VSS) U2.V3(VSS) U2.V5(VSS) U2.V7(VSS) U2.V9(VSS) U2.V11(VSS) U2.V13(VSS) U2.V15(VSS) U2.V17(VSS) U2.V20(VSS) U2.V22(VSS) U2.V24(VSS) U2.V26(VSS) U2.V28(VSS) U2.V30(VSS) U2.W7(VSS) U2.W9(VSS) U2.W11(VSS) U2.W13(VSS) U2.W15(VSS) U2.W17(VSS) U2.W20(VSS) U2.W22(VSS) U2.W24(VSS) U2.W26(VSS) U2.W28(VSS) U2.W30(VSS) U2.W32(VSS) U2.W34(VSS) U2.W36(VSS) U2.Y5(VSS) U2.Y6(VSS) U2.Y8(VSS) U2.Y10(VSS) U2.Y12(VSS) U2.Y14(VSS) U2.Y16(VSS) U2.Y18(VSS) U2.Y19(VSS) U2.Y21(VSS) U2.Y23(VSS) U2.Y25(VSS) U2.Y27(VSS) U2.Y29(VSS) U2.Y31(VSS) U2.Y33(VSS) ; port GND

## Notes on the sheet
- Block Name
- Document Type: Schematic
- Size
- File Name
- Variant
- Rev.
- Project Name
- Sheet
- /

## Library data of the parts
C267-C306 = CAP000028169: DB_PART_TYPE: Ceramic_SMD\Standard_X7R; DB_MANUFACTURER_PART: KEMET    C0603C474J4RAC; NOTE: <NOTE>; DB_T_RANGE: -55 to 125; DB_PACKAGE: 0603; DB_DESCRIPTION: C X7R 470nF 5% 16V 0603; DB_APPROVED_ON: 09.10.2010 г.; DB_STATUS: NEW; DB_PART_NUMBER: CAP000028169; DB_PCB_DEVICE: SMD_0603_CAPC1608X95N; DB_DATASHEET: http://john.epiqdesign.com/projects/CIS_Datasheets/F3102_CE_Kemet.pdf?rev=92&sc=0
C307-C346 = CAP000047355: DB_PART_TYPE: Ceramic_SMD\Standard_X5R; DB_MANUFACTURER_PART: SAMSUNG    CL32A227MQVNNNE; NOTE: <NOTE>; DB_T_RANGE: -55 to 85; DB_PACKAGE: 1210; DB_DESCRIPTION: C X5R 220uF 20% 6.3V 1210; DB_APPROVED_BY: VSN; DB_APPROVED_ON: 07.5.2014 г. 11:28:08; DB_STATUS: NEW; DB_PART_NUMBER: CAP000047355; DB_PCB_DEVICE: SMD_1210_CAPC3225X279N; DB_DATASHEET: http://john.epiqdesign.com/projects/CIS_Datasheets/CAP_CL32A227MQVNNNE.pdf?rev=1401&sc=0
U2 = Goldstrike1: DB_PCB_DEVICE: SMD_BGA1296C100P36X36